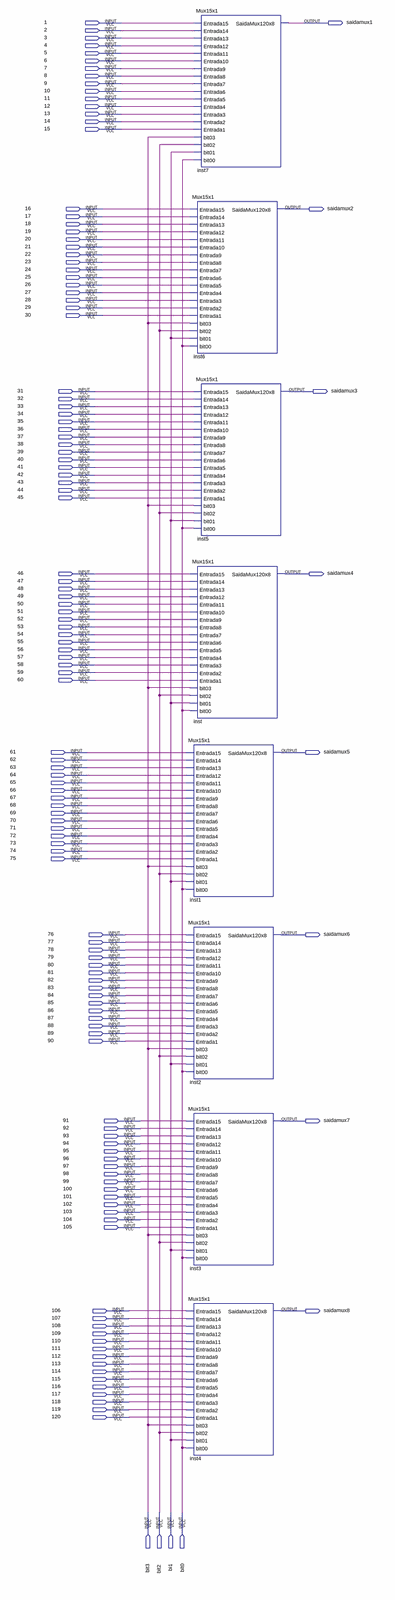
[diagram p0: schematic sheet, whole]
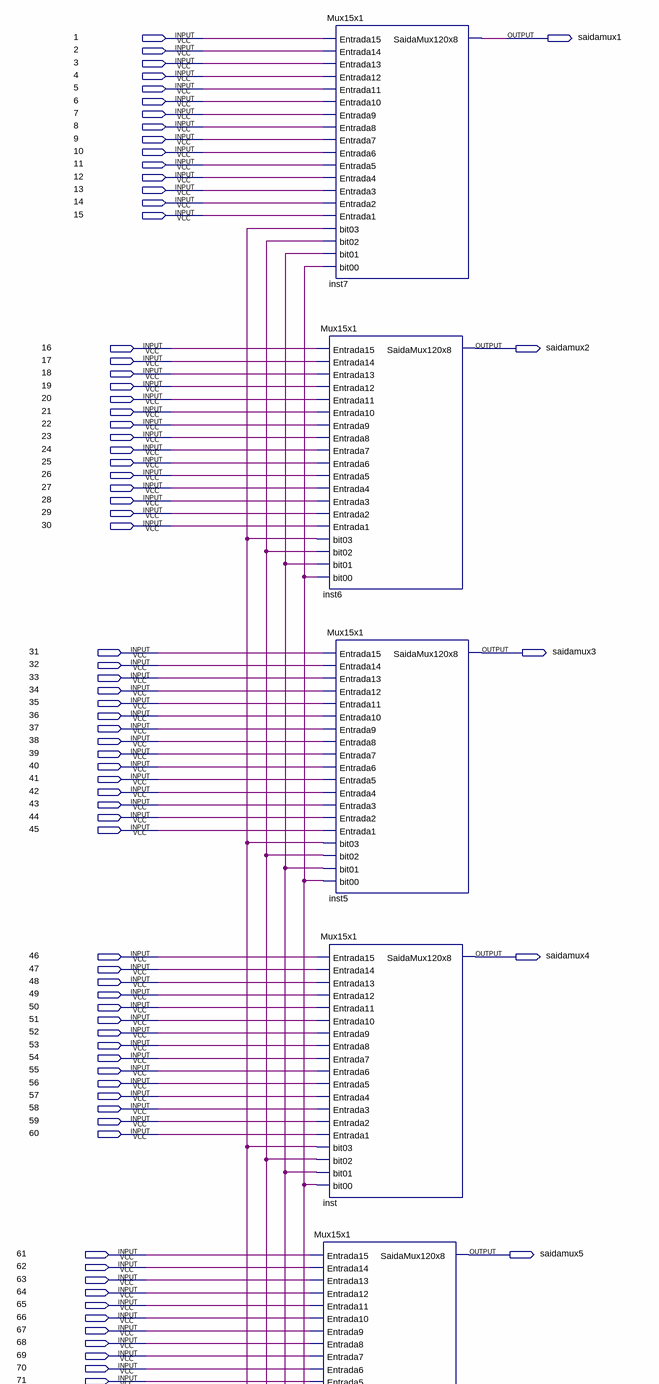
[diagram p1: schematic sheet, upper part]
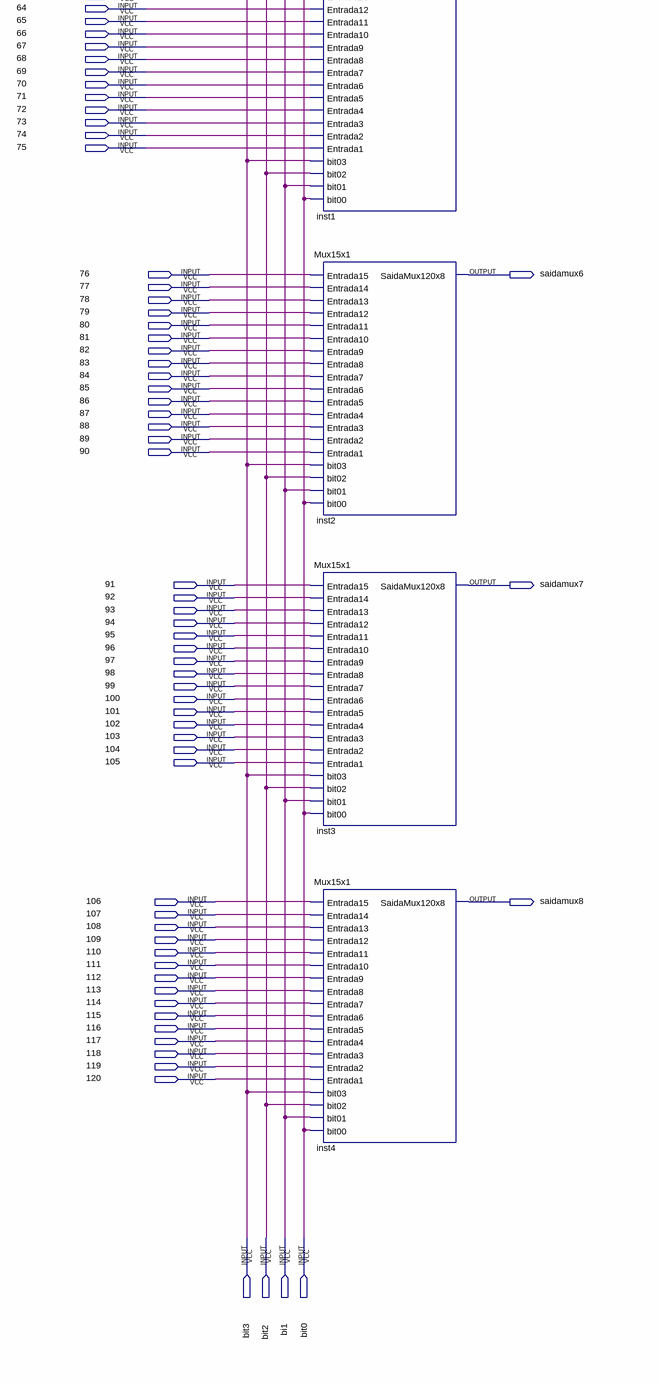
[diagram p2: schematic sheet, lower part]
// Quartus schematic Mux120x8.bdf as structural Verilog: 8 symbols, 132 pins
module Mux120x8 (
  input  \1 ,
  input  \2 ,
  input  \3 ,
  input  \4 ,
  input  \5 ,
  input  \6 ,
  input  \7 ,
  input  \8 ,
  input  \9 ,
  input  \10 ,
  input  \11 ,
  input  \12 ,
  input  \13 ,
  input  \14 ,
  input  \15 ,
  input  \16 ,
  input  \17 ,
  input  \18 ,
  input  \19 ,
  input  \20 ,
  input  \21 ,
  input  \22 ,
  input  \23 ,
  input  \24 ,
  input  \25 ,
  input  \26 ,
  input  \27 ,
  input  \28 ,
  input  \29 ,
  input  \30 ,
  input  \31 ,
  input  \32 ,
  input  \33 ,
  input  \34 ,
  input  \35 ,
  input  \36 ,
  input  \37 ,
  input  \38 ,
  input  \39 ,
  input  \40 ,
  input  \41 ,
  input  \42 ,
  input  \43 ,
  input  \44 ,
  input  \45 ,
  input  \46 ,
  input  \47 ,
  input  \48 ,
  input  \49 ,
  input  \50 ,
  input  \51 ,
  input  \52 ,
  input  \53 ,
  input  \54 ,
  input  \55 ,
  input  \56 ,
  input  \57 ,
  input  \58 ,
  input  \59 ,
  input  \60 ,
  input  \61 ,
  input  \62 ,
  input  \63 ,
  input  \64 ,
  input  \65 ,
  input  \66 ,
  input  \67 ,
  input  \68 ,
  input  \69 ,
  input  \70 ,
  input  \71 ,
  input  \72 ,
  input  \73 ,
  input  \74 ,
  input  \75 ,
  input  \76 ,
  input  \77 ,
  input  \78 ,
  input  \79 ,
  input  \80 ,
  input  \81 ,
  input  \82 ,
  input  \83 ,
  input  \84 ,
  input  \85 ,
  input  \86 ,
  input  \87 ,
  input  \88 ,
  input  \89 ,
  input  \90 ,
  input  \91 ,
  input  \92 ,
  input  \93 ,
  input  \94 ,
  input  \95 ,
  input  \96 ,
  input  \97 ,
  input  \98 ,
  input  \99 ,
  input  \100 ,
  input  \101 ,
  input  \102 ,
  input  \103 ,
  input  \104 ,
  input  \105 ,
  input  \106 ,
  input  \107 ,
  input  \108 ,
  input  \109 ,
  input  \110 ,
  input  \111 ,
  input  \112 ,
  input  \113 ,
  input  \114 ,
  input  \115 ,
  input  \116 ,
  input  \117 ,
  input  \118 ,
  input  \119 ,
  input  \120 ,
  input  bit3,
  input  bit2,
  input  bi1,
  input  bit0,
  output saidamux1,
  output saidamux2,
  output saidamux3,
  output saidamux4,
  output saidamux5,
  output saidamux6,
  output saidamux7,
  output saidamux8
);

  Mux15x1 inst6 (
    .Entrada15(\16 ), .Entrada14(\17 ), .Entrada13(\18 ), .Entrada12(\19 ), .Entrada11(\20 ),
    .Entrada10(\21 ), .Entrada9(\22 ), .Entrada8(\23 ), .Entrada7(\24 ), .Entrada6(\25 ), .Entrada5(\26 ),
    .Entrada4(\27 ), .Entrada3(\28 ), .Entrada2(\29 ), .Entrada1(\30 ), .bit03(bit3), .bit02(bit2),
    .bit01(bi1), .bit00(bit0), .SaidaMux120x8(saidamux2));
  Mux15x1 inst (
    .Entrada15(\46 ), .Entrada14(\47 ), .Entrada13(\48 ), .Entrada12(\49 ), .Entrada11(\50 ),
    .Entrada10(\51 ), .Entrada9(\52 ), .Entrada8(\53 ), .Entrada7(\54 ), .Entrada6(\55 ), .Entrada5(\56 ),
    .Entrada4(\57 ), .Entrada3(\58 ), .Entrada2(\59 ), .Entrada1(\60 ), .bit03(bit3), .bit02(bit2),
    .bit01(bi1), .bit00(bit0), .SaidaMux120x8(saidamux4));
  Mux15x1 inst1 (
    .Entrada15(\61 ), .Entrada14(\62 ), .Entrada13(\63 ), .Entrada12(\64 ), .Entrada11(\65 ),
    .Entrada10(\66 ), .Entrada9(\67 ), .Entrada8(\68 ), .Entrada7(\69 ), .Entrada6(\70 ), .Entrada5(\71 ),
    .Entrada4(\72 ), .Entrada3(\73 ), .Entrada2(\74 ), .Entrada1(\75 ), .bit03(bit3), .bit02(bit2),
    .bit01(bi1), .bit00(bit0), .SaidaMux120x8(saidamux5));
  Mux15x1 inst2 (
    .Entrada15(\76 ), .Entrada14(\77 ), .Entrada13(\78 ), .Entrada12(\79 ), .Entrada11(\80 ),
    .Entrada10(\81 ), .Entrada9(\82 ), .Entrada8(\83 ), .Entrada7(\84 ), .Entrada6(\85 ), .Entrada5(\86 ),
    .Entrada4(\87 ), .Entrada3(\88 ), .Entrada2(\89 ), .Entrada1(\90 ), .bit03(bit3), .bit02(bit2),
    .bit01(bi1), .bit00(bit0), .SaidaMux120x8(saidamux6));
  Mux15x1 inst3 (
    .Entrada15(\91 ), .Entrada14(\92 ), .Entrada13(\93 ), .Entrada12(\94 ), .Entrada11(\95 ),
    .Entrada10(\96 ), .Entrada9(\97 ), .Entrada8(\98 ), .Entrada7(\99 ), .Entrada6(\100 ), .Entrada5(\101 ),
    .Entrada4(\102 ), .Entrada3(\103 ), .Entrada2(\104 ), .Entrada1(\105 ), .bit03(bit3), .bit02(bit2),
    .bit01(bi1), .bit00(bit0), .SaidaMux120x8(saidamux7));
  Mux15x1 inst4 (
    .Entrada15(\106 ), .Entrada14(\107 ), .Entrada13(\108 ), .Entrada12(\109 ), .Entrada11(\110 ),
    .Entrada10(\111 ), .Entrada9(\112 ), .Entrada8(\113 ), .Entrada7(\114 ), .Entrada6(\115 ),
    .Entrada5(\116 ), .Entrada4(\117 ), .Entrada3(\118 ), .Entrada2(\119 ), .Entrada1(\120 ), .bit03(bit3),
    .bit02(bit2), .bit01(bi1), .bit00(bit0), .SaidaMux120x8(saidamux8));
  Mux15x1 inst7 (
    .Entrada15(\1 ), .Entrada14(\2 ), .Entrada13(\3 ), .Entrada12(\4 ), .Entrada11(\5 ), .Entrada10(\6 ),
    .Entrada9(\7 ), .Entrada8(\8 ), .Entrada7(\9 ), .Entrada6(\10 ), .Entrada5(\11 ), .Entrada4(\12 ),
    .Entrada3(\13 ), .Entrada2(\14 ), .Entrada1(\15 ), .bit03(bit3), .bit02(bit2), .bit01(bi1), .bit00(bit0),
    .SaidaMux120x8(saidamux1));
  Mux15x1 inst5 (
    .Entrada15(\31 ), .Entrada14(\32 ), .Entrada13(\33 ), .Entrada12(\34 ), .Entrada11(\35 ),
    .Entrada10(\36 ), .Entrada9(\37 ), .Entrada8(\38 ), .Entrada7(\39 ), .Entrada6(\40 ), .Entrada5(\41 ),
    .Entrada4(\42 ), .Entrada3(\43 ), .Entrada2(\44 ), .Entrada1(\45 ), .bit03(bit3), .bit02(bit2),
    .bit01(bi1), .bit00(bit0), .SaidaMux120x8(saidamux3));
endmodule
